# EAGLE design Power Bus (EAGLE 5.07)
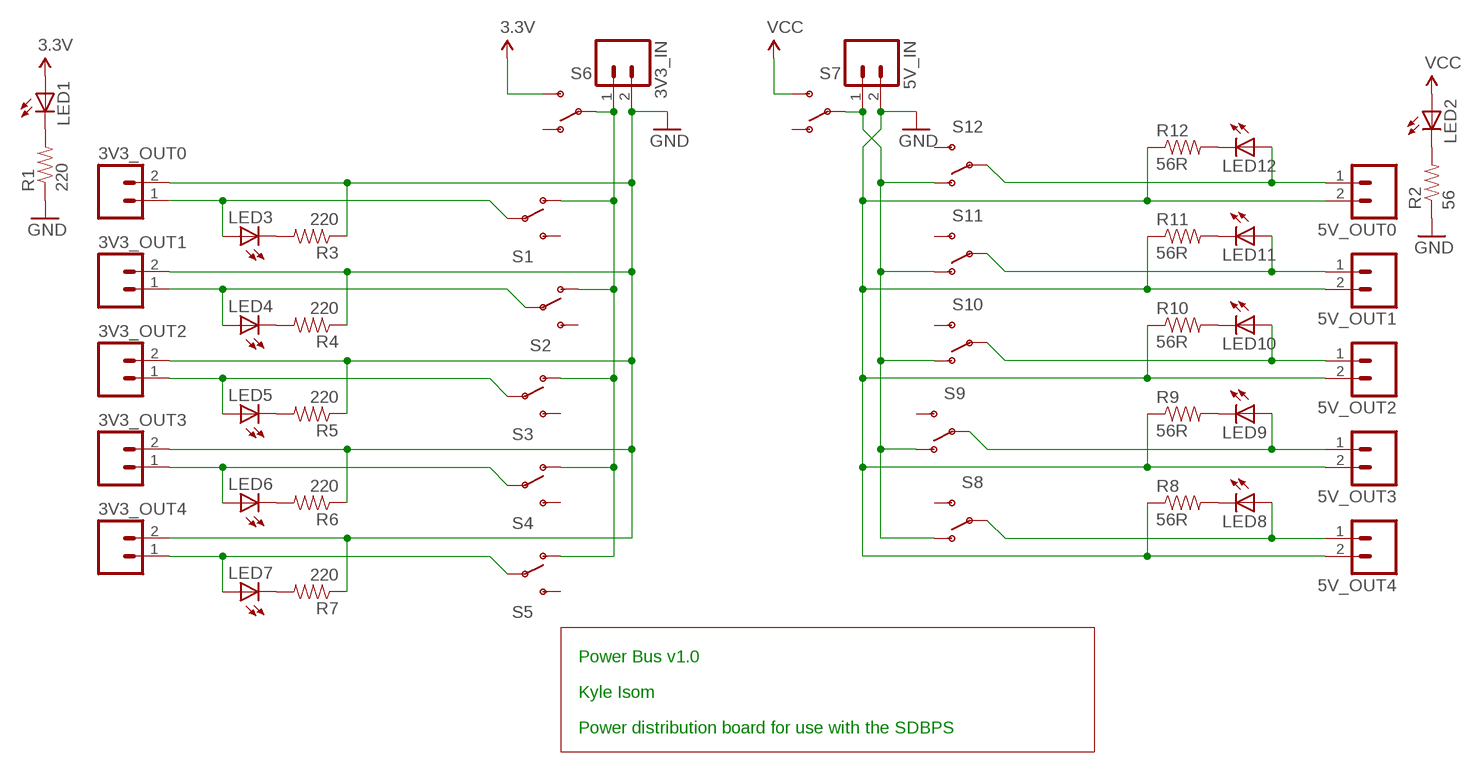
[diagram p0: schematic, sheet 1]

## Parts
3V3_IN  M02POLAR_LOCK  [MOLEX-1X2_LOCK]
3V3_OUT0  M02POLAR_LOCK  [MOLEX-1X2_LOCK]
3V3_OUT1  M02POLAR_LOCK  [MOLEX-1X2_LOCK]
3V3_OUT2  M02POLAR_LOCK  [MOLEX-1X2_LOCK]
3V3_OUT3  M02POLAR_LOCK  [MOLEX-1X2_LOCK]
3V3_OUT4  M02POLAR_LOCK  [MOLEX-1X2_LOCK]
5V_IN  M02POLAR_LOCK  [MOLEX-1X2_LOCK]
5V_OUT0  M02POLAR_LOCK  [MOLEX-1X2_LOCK]
5V_OUT1  M02POLAR_LOCK  [MOLEX-1X2_LOCK]
5V_OUT2  M02POLAR_LOCK  [MOLEX-1X2_LOCK]
5V_OUT3  M02POLAR_LOCK  [MOLEX-1X2_LOCK]
5V_OUT4  M02POLAR_LOCK  [MOLEX-1X2_LOCK]
LED1  LED0603  [LED-0603]
LED2  LED0603  [LED-0603]
LED3  LED0603  [LED-0603]
LED4  LED0603  [LED-0603]
LED5  LED0603  [LED-0603]
LED6  LED0603  [LED-0603]
LED7  LED0603  [LED-0603]
LED8  LED0603  [LED-0603]
LED9  LED0603  [LED-0603]
LED10  LED0603  [LED-0603]
LED11  LED0603  [LED-0603]
LED12  LED0603  [LED-0603]
R1  220  RESISTOR0603-RES  [0603-RES]
R2  56  RESISTOR0603-RES  [0603-RES]
R3  220  RESISTOR0603-RES  [0603-RES]
R4  220  RESISTOR0603-RES  [0603-RES]
R5  220  RESISTOR0603-RES  [0603-RES]
R6  220  RESISTOR0603-RES  [0603-RES]
R7  220  RESISTOR0603-RES  [0603-RES]
R8  56R  RESISTOR0603-RES  [0603-RES]
R9  56R  RESISTOR0603-RES  [0603-RES]
R10  56R  RESISTOR0603-RES  [0603-RES]
R11  56R  RESISTOR0603-RES  [0603-RES]
R12  56R  RESISTOR0603-RES  [0603-RES]
S1  SWITCH-SPSTPTH_LOCK  [SWITCH-SPDT_LOCK.007S]
S2  SWITCH-SPSTPTH_LOCK  [SWITCH-SPDT_LOCK.007S]
S3  SWITCH-SPSTPTH_LOCK  [SWITCH-SPDT_LOCK.007S]
S4  SWITCH-SPSTPTH_LOCK  [SWITCH-SPDT_LOCK.007S]
S5  SWITCH-SPSTPTH_LOCK  [SWITCH-SPDT_LOCK.007S]
S6  SWITCH-SPSTPTH_LOCK  [SWITCH-SPDT_LOCK.007S]
S7  SWITCH-SPSTPTH_LOCK  [SWITCH-SPDT_LOCK.007S]
S8  SWITCH-SPSTPTH_LOCK  [SWITCH-SPDT_LOCK.007S]
S9  SWITCH-SPSTPTH_LOCK  [SWITCH-SPDT_LOCK.007S]
S10  SWITCH-SPSTPTH_LOCK  [SWITCH-SPDT_LOCK.007S]
S11  SWITCH-SPSTPTH_LOCK  [SWITCH-SPDT_LOCK.007S]
S12  SWITCH-SPSTPTH_LOCK  [SWITCH-SPDT_LOCK.007S]

## Nets
3.3V: LED1.A S6.3(S)
GND: 3V3_IN.2 3V3_OUT0.2 3V3_OUT1.2 3V3_OUT2.2 3V3_OUT3.2 3V3_OUT4.2 5V_IN.2 5V_OUT0.2 5V_OUT1.2 5V_OUT2.2 5V_OUT3.2 5V_OUT4.2 R1.1 R2.1 R3.1 R4.1 R5.1 R6.1 R7.1 R8.1 R9.1 R10.1 R11.1 R12.1
N$1: LED1.C R1.2
N$2: LED2.C R2.2
N$3: 3V3_OUT0.1 LED3.A S1.2(P)
N$4: LED3.C R3.2
N$5: 3V3_IN.1 S1.1(O) S2.1(O) S3.1(O) S4.1(O) S5.1(O) S6.2(P)
N$6: 3V3_OUT1.1 LED4.A S2.2(P)
N$7: 5V_OUT4.1 LED8.A S8.2(P)
N$8: LED4.C R4.2
N$9: 3V3_OUT2.1 LED5.A S3.2(P)
N$10: LED5.C R5.2
N$11: 3V3_OUT3.1 LED6.A S4.2(P)
N$12: LED6.C R6.2
N$13: 3V3_OUT4.1 LED7.A S5.2(P)
N$14: LED7.C R7.2
N$15: LED8.C R8.2
N$16: 5V_IN.1 S7.2(P) S8.1(O) S9.1(O) S10.1(O) S11.1(O) S12.1(O)
N$17: LED9.C R9.2
N$18: LED10.C R10.2
N$19: LED11.C R11.2
N$20: LED12.C R12.2
N$21: 5V_OUT0.1 LED12.A S12.2(P)
N$22: 5V_OUT1.1 LED11.A S11.2(P)
N$23: 5V_OUT2.1 LED10.A S10.2(P)
N$24: 5V_OUT3.1 LED9.A S9.2(P)
VCC: LED2.A S7.3(S)
Unconnected: S1.3(S) S2.3(S) S3.3(S) S4.3(S) S5.3(S) S6.1(O) S7.1(O) S8.3(S) S9.3(S) S10.3(S) S11.3(S) S12.3(S)

## Notes on the sheet
- Power Bus v1.0
- Kyle Isom
- Power distribution board for use with the SDBPS

## Library data of the parts
3V3_IN 3V3_OUT0 3V3_OUT1-3V3_OUT4 5V_IN 5V_OUT0 5V_OUT1-5V_OUT4 = SparkFun:M02: Header 2 Standard 2-pin 0.1" header. Use with straight break away headers (SKU : PRT-00116), right angle break away headers (PRT-00553), swiss pins (PRT-00743), machine pins (PRT-00117), and female headers (PRT-00115). Molex polarized connector foot print use with SKU : PRT-08233 with associated crimp pins and housings.
LED1-LED12 = SparkFun:LED: LEDs Standard schematic elements and footprints for 5mm, 3mm, 1206, and 0603 sized LEDs. 5mm - Spark Fun Electronics SKU : COM-00529 (and others)
R1-R12 = SparkFun:RESISTOR: Resistor Basic schematic elements and footprints for 0603, 1206, and PTH 1/10th watt (small) resistors.
S1-S12 = SparkFun:SWITCH-SPST: SPST Switch Simple slide switch. Spark Fun Electronics SKU : COM-00102

## Board
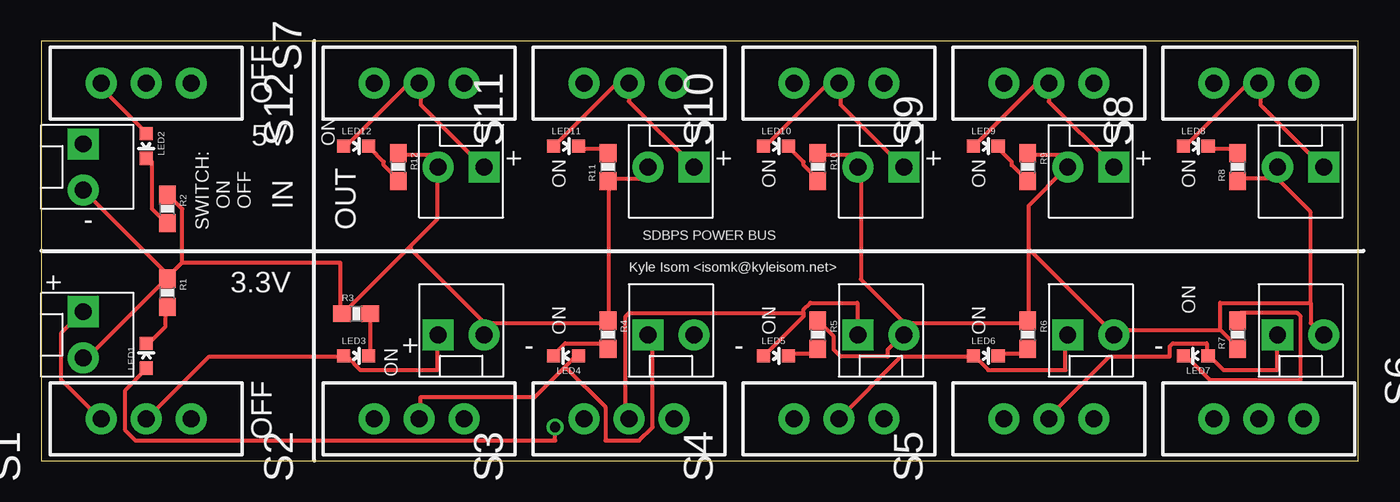
[diagram p1: board, top side]
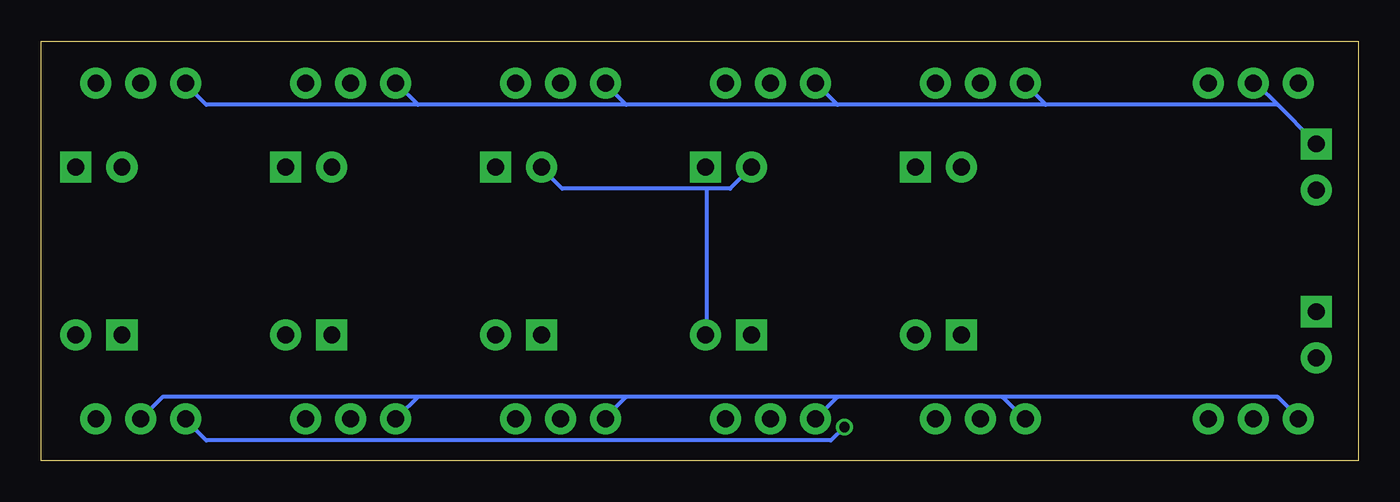
[diagram p2: board, bottom side, seen from below]

Size 79.68 x 25.39 mm. Coordinates in mm from the lower left corner, seen from the top.
Outline: 0,0 79.68,0 79.68,25.39 0,25.39 0,0
Copper layers (1*16): Top 0.035mm / dielectric 1.5mm / Bottom 0.035mm
Design rules "default": minimum track width 10mil, minimum drill 24mil, track to track 8mil, track to pad 8mil, pad to pad 8mil, via to via 8mil, smd to smd 8mil, copper to edge 40mil, drill to drill 8mil, minimum pad ring 10mil, minimum via ring 8mil, stop-mask expansion 4mil, vias tented up to drill 0mil, thermal gap 10mil

### Footprints (pad centres in the part's own frame; a part is rotated, then mirrored left to right if it is on the bottom)
MOLEX-1X2_LOCK = drill 1.016 pad 1.88 square: 1 -0.127,0 | drill 1.016 pad 1.88 round: 2 2.667,0
LED-0603 = smd 0.8 x 0.8: A 0,-0.75; C 0,0.75
0603-RES = smd 1.1 x 1: 1 -0.85,0; 2 0.85,0
SWITCH-SPDT_LOCK.007S = drill 1.016 pad 1.88 round: 1 0,2.718; 2 0,0; 3 0,-2.718

### Placement (x,y rotation side)
3V3_IN  2.54,8.89 270 top
3V3_OUT0  24.13,7.62 0 top
3V3_OUT1  36.83,7.62 0 top
3V3_OUT2  49.53,7.62 0 top
3V3_OUT3  62.23,7.62 0 top
3V3_OUT4  74.93,7.62 0 top
5V_IN  2.54,19.05 270 top
5V_OUT0  26.67,17.78 180 top
5V_OUT1  39.37,17.78 180 top
5V_OUT2  52.07,17.78 180 top
5V_OUT3  64.77,17.78 180 top
5V_OUT4  77.47,17.78 180 top
LED1  6.35,6.35 0 top
LED2  6.35,19.05 180 top
LED3  19.05,6.35 270 top
LED4  31.75,6.35 90 top
LED5  44.45,6.35 270 top
LED6  57.15,6.35 270 top
LED7  69.85,6.35 90 top
LED8  69.85,19.05 270 top
LED9  57.15,19.05 270 top
LED10  44.45,19.05 270 top
LED11  31.75,19.05 270 top
LED12  19.05,19.05 270 top
R1  7.62,10.16 270 top
R2  7.62,15.24 270 top
R3  19.05,8.89 0 top
R4  34.29,7.62 270 top
R5  46.99,7.62 270 top
R6  59.69,7.62 270 top
R7  72.39,7.62 90 top
R8  72.39,17.78 90 top
R9  59.69,17.78 270 top
R10  46.99,17.78 270 top
R11  34.29,17.78 90 top
R12  21.59,17.78 270 top
S1  6.35,2.54 90 top
S2  22.86,2.54 90 top
S3  35.56,2.54 90 top
S4  48.26,2.54 90 top
S5  60.96,2.54 90 top
S6  73.66,2.54 270 top
S7  6.35,22.86 270 top
S8  73.66,22.86 90 top
S9  60.96,22.86 90 top
S10  48.26,22.86 90 top
S11  35.56,22.86 90 top
S12  22.86,22.86 90 top

### Tracks (layer width: path | path; a pad name or v marks a point on that pad's centre or on a via)
3.3V  (via drill 0.61)
  Top 0.254: v31.09,2.03 31.09,1.22 5.69,1.22 5.08,1.83 5.08,4.27 6.3,5.49 LED1.A
  Bottom 0.254: v31.09,2.03 31.9,1.22 69.7,1.22 70.92,2.44 S6.3
GND
  Top 0.254: 74.78,17.07 72.54,17.07 R8.1 | 74.78,17.07 74.78,17.68 5V_OUT4.2 74.78,17.07 | 76.81,9.55 76.81,15.04 74.78,17.07 | 76.81,9.55 76.81,8.33 77.42,7.72 3V3_OUT4.2 | 71.32,7.92 72.34,6.91 R7.1 | 71.32,7.92 65.02,7.92 65.02,7.72 3V3_OUT3.2 64.82,7.72 59.74,12.8 | R9.1 59.74,18.49 61.98,18.49 61.98,17.88 5V_OUT3.2 61.98,17.68 59.74,15.44 59.74,12.8 | R5.1 47.14,8.33 47.95,7.52 47.95,6.71 48.36,6.3 51.21,6.3 51.21,6.71 52.02,7.52 3V3_OUT2.2 | 52.22,8.33 59.54,8.33 R6.1 59.74,8.53 59.74,12.8 | 52.22,8.33 52.22,7.72 3V3_OUT2.2 | 76.81,9.55 71.32,9.55 71.32,7.92 | R10.1 47.14,18.49 49.38,18.49 49.38,17.88 5V_OUT2.2 49.58,17.68 49.58,10.97 52.22,8.33 | 5V_OUT1.2 36.58,17.68 36.58,17.07 34.34,17.07 R11.1 34.34,16.87 34.34,8.53 R4.1 34.14,8.33 26.82,8.33 | R1.1 7.52,10.97 2.64,6.1 3V3_IN.2 | 8.53,11.99 8.53,15.24 7.72,16.05 R2.1 | 8.53,11.99 7.72,11.18 R1.1 | 5V_IN.2 2.64,16.26 7.52,11.38 7.52,11.18 R1.1 | 26.82,8.33 26.82,7.72 3V3_OUT0.2 26.82,8.33 | 22.35,13.01 23.98,14.63 23.98,17.68 5V_OUT0.2 23.98,17.88 23.98,18.49 21.74,18.49 R12.1 | 22.35,13.01 18.29,8.94 R3.1 18.09,8.94 18.09,11.99 8.53,11.99 | 26.82,8.33 22.35,12.8 22.35,13.01 | 52.22,8.33 3V3_OUT2.2
  Bottom 0.254: 39.42,16.46 39.42,7.72 3V3_OUT1.2 | 39.42,16.46 38,16.46 36.78,17.68 5V_OUT1.2 | 39.42,16.46 48.16,16.46 49.38,17.68 5V_OUT2.2
N$1
  Top 0.254: LED1.C 6.5,7.11 7.52,8.13 7.52,9.14 R1.2
N$2
  Top 0.254: LED2.C 6.5,18.29 6.71,18.09 6.71,15.24 7.52,14.43 R2.2
N$3
  Top 0.254: 3V3_OUT0.1 23.98,7.52 23.98,5.49 19.3,5.49 18.49,6.3 LED3.A 18.29,6.3 10.16,6.3 6.5,2.64 S1.2
N$4
  Top 0.254: LED3.C 19.91,6.5 19.91,8.74 R3.2
N$5
  Top 0.254: S1.1 3.45,2.64 1.22,4.88 1.22,7.72 2.44,8.94 3V3_IN.1
  Bottom 0.254: 21.54,3.86 20.32,2.64 S2.1 | 21.54,3.86 31.5,3.86 | 31.5,3.86 32.72,2.64 S3.1 | 44.3,3.86 45.52,2.64 S4.1 | 31.5,3.86 44.3,3.86 | 56.9,3.86 58.12,2.64 S5.1 | 44.3,3.86 56.9,3.86 | 56.9,3.86 72.34,3.86 S6.2 | 21.54,3.86 4.88,3.86 3.66,2.64 S1.1
N$6
  Top 0.254: 31.7,5.69 29.87,3.86 22.96,3.86 22.96,2.64 S2.2 | 31.7,5.69 32.31,6.3 LED4.A | 31.7,5.69 34.14,3.25 34.14,1.22 36.17,1.22 36.98,2.03 36.98,7.32 36.78,7.52 3V3_OUT1.1
N$7
  Top 0.254: LED8.A 69.29,19.1 72.95,22.76 73.56,22.76 S8.2 73.76,22.76 73.76,21.54 77.42,17.88 5V_OUT4.1
N$8
  Top 0.254: LED4.C 31.09,6.5 31.7,7.11 34.14,7.11 34.14,6.91 R4.2
N$9
  Top 0.254: 46.13,8.94 46.13,9.14 46.53,9.55 49.38,9.55 49.38,7.72 3V3_OUT2.1 | 46.13,8.94 46.13,8.74 43.89,6.5 LED5.A | 46.13,8.94 35.56,8.94 35.36,8.74 35.36,2.85 35.56,2.64 S3.2
N$10
  Top 0.254: LED5.C 45.31,6.5 46.94,6.5 46.94,6.71 R5.2
N$11
  Top 0.254: 3V3_OUT3.1 61.98,7.52 61.98,5.49 57.3,5.49 56.49,6.3 LED6.A 56.29,6.3 52.02,6.3 S4.2
N$12
  Top 0.254: LED6.C 57.91,6.5 59.54,6.5 59.54,6.71 R6.2
N$13
  Top 0.254: 3V3_OUT4.1 74.78,7.52 74.78,5.49 71.53,5.49 70.71,6.3 LED7.A 70.51,6.5 70.51,7.11 68.48,7.11 68.28,6.91 68.28,6.3 64.62,6.3 60.96,2.64 S5.2
N$14
  Top 0.254: LED7.C 69.29,6.3 70.71,4.88 76.2,4.88 76.2,8.74 76,8.94 72.54,8.94 72.54,8.53 R7.2
N$15
  Top 0.254: LED8.C 70.71,18.9 72.34,18.9 72.34,18.69 R8.2
N$16
  Bottom 0.254: 4.88,21.54 6.1,22.76 6.3,22.76 S7.2 | 4.88,21.54 2.64,19.3 5V_IN.1 | 18.9,21.54 20.12,22.76 S12.1 | 4.88,21.54 18.9,21.54 | 31.5,21.54 32.72,22.76 S11.1 | 18.9,21.54 31.5,21.54 | 44.3,21.54 45.52,22.76 S10.1 | 31.5,21.54 44.3,21.54 | 56.9,21.54 58.12,22.76 S9.1 | 44.3,21.54 56.9,21.54 | 56.9,21.54 69.7,21.54 70.92,22.76 S8.1
N$17
  Top 0.254: LED9.C 57.91,18.9 58.73,18.09 58.73,17.88 59.54,17.07 R9.2
N$18
  Top 0.254: LED10.C 45.31,18.9 46.13,18.09 46.13,17.88 46.94,17.07 R10.2
N$19
  Top 0.254: LED11.C 32.51,18.9 34.14,18.9 34.14,18.69 R11.2
N$20
  Top 0.254: LED12.C 19.91,18.9 20.73,18.09 20.73,17.88 21.54,17.07 R12.2
N$21
  Top 0.254: LED12.A 18.49,19.1 22.15,22.76 22.76,22.76 S12.2 22.96,22.76 22.96,21.54 26.62,17.88 5V_OUT0.1
N$22
  Top 0.254: 35.56,22.76 34.75,22.76 31.09,19.1 LED11.A | 35.56,22.76 35.56,21.74 39.42,17.88 5V_OUT1.1 | 35.56,22.76 S11.2
N$23
  Top 0.254: LED10.A 43.89,19.1 47.55,22.76 48.16,22.76 S10.2 48.36,22.76 48.36,21.54 52.02,17.88 5V_OUT2.1
N$24
  Top 0.254: 60.96,22.76 60.15,22.76 56.49,19.1 LED9.A | 60.96,22.76 60.96,21.74 64.82,17.88 5V_OUT3.1 | 60.96,22.76 S9.2
VCC
  Top 0.254: LED2.A 6.3,19.91 3.66,22.55 3.66,22.76 S7.3

### Text on the board
tPlace: OFF | 5V | ON | + | + | + | + | ON | ON | ON | ON | ON | OFF | IN | - | SWITCH: | OUT | SDBPS POWER BUS | + | Kyle Isom <isomk@kyleisom.net> | 3.3V | ON | + | ON | ON | ON | - | - | - | ON | OFF